# Altium schematic sheet FIT_FPGA_I-J-K.SchDoc: FIT_PM12 board
size 420 x 297 mm; CheckedBy: G.Kasprowicz; Author: INR Moscow; CompanyName: WUT ISE; DrawnBy: M.Podgórski; Organization: WUT ISE; Address1: PW ISE; Address2: Nowowiejska 15/19 00-665 Warsaw; Address3: gkasprow@gmail.com; Revision: 2; SheetNumber: -; SheetTotal: -; ModifiedBy: -; CheckedDate: -; Title2: Title 2; DivGrp: WUT ISE; Designer: INR RAS; ModifiedDate: -; ProjectName: Sensor Box
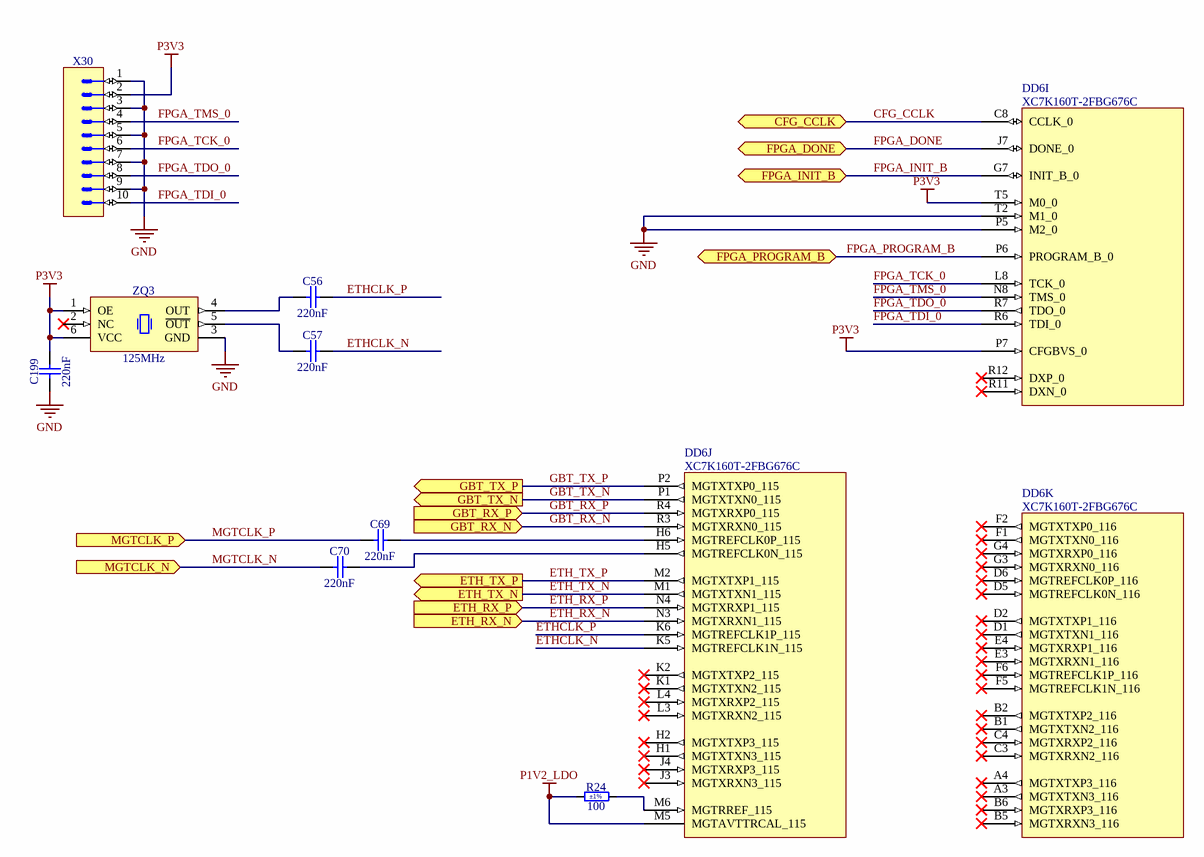
[diagram p0: FIT_FPGA_I-J-K.SchDoc]

## Parts
C56  220nF  [CAPC1608X87N]
C57  220nF  [CAPC1608X87N]
C69  220nF  [CAPC1608X87N]
C70  220nF  [CAPC1608X87N]
C199  220nF  [CAPC2012X135N]
DD6  XC7K160T-2FBG676C  [BGA676C100P26X26_2700X2700X254]  (parts I,J,K of 15)
R24  100  Tolerance: ±1%  [RESC1608X55N]
X30  (no value)  [CONNFLY_DS1014-10SF1B-B]
ZQ3  125MHz  [OSC_EPSON_SG5032VAN]

## Ports
CFG_CCLK (bidir), ETH_RX_N (in), ETH_RX_P (in), ETH_TX_N (out), ETH_TX_P (out), FPGA_DONE (bidir), FPGA_INIT_B (bidir), FPGA_PROGRAM_B (bidir), GBT_RX_N (in), GBT_RX_P (in), GBT_TX_N (out), GBT_TX_P (out), MGTCLK_N (in), MGTCLK_P (in)

## Nets
GND: C199.1 DD6.P5(M2_0) DD6.T2(M1_0) X30.1 X30.3 X30.5 X30.7 X30.9 ZQ3.3(GND)
P1V2_LDO: DD6.M5(MGTAVTTRCAL_115) R24.1
P3V3: C199.2 DD6.P7(CFGBVS_0) DD6.T5(M0_0) X30.2 ZQ3.1(OE) ZQ3.6(VCC)
CFG_CCLK: DD6.C8(CCLK_0) ; port CFG_CCLK
ETH_RX_N: DD6.N3(MGTXRXN1_115) ; port ETH_RX_N
ETH_RX_P: DD6.N4(MGTXRXP1_115) ; port ETH_RX_P
ETH_TX_N: DD6.M1(MGTXTXN1_115) ; port ETH_TX_N
ETH_TX_P: DD6.M2(MGTXTXP1_115) ; port ETH_TX_P
ETHCLK_N: C57.2 DD6.K5(MGTREFCLK1N_115)
ETHCLK_P: C56.2 DD6.K6(MGTREFCLK1P_115)
FPGA_DONE: DD6.J7(DONE_0) ; port FPGA_DONE
FPGA_INIT_B: DD6.G7(INIT_B_0) ; port FPGA_INIT_B
FPGA_PROGRAM_B: DD6.P6(PROGRAM_B_0) ; port FPGA_PROGRAM_B
FPGA_TCK_0: DD6.L8(TCK_0) X30.6
FPGA_TDI_0: DD6.R6(TDI_0) X30.10
FPGA_TDO_0: DD6.R7(TDO_0) X30.8
FPGA_TMS_0: DD6.N8(TMS_0) X30.4
GBT_RX_N: DD6.R3(MGTXRXN0_115) ; port GBT_RX_N
GBT_RX_P: DD6.R4(MGTXRXP0_115) ; port GBT_RX_P
GBT_TX_N: DD6.P1(MGTXTXN0_115) ; port GBT_TX_N
GBT_TX_P: DD6.P2(MGTXTXP0_115) ; port GBT_TX_P
MGTCLK_N: C70.1 ; port MGTCLK_N
MGTCLK_P: C69.1 ; port MGTCLK_P
NetC56_1: C56.1 ZQ3.4(OUT)
NetC57_1: C57.1 ZQ3.5(~{OUT})
NetC69_2: C69.2 DD6.H6(MGTREFCLK0P_115)
NetC70_2: C70.2 DD6.H5(MGTREFCLK0N_115)
NetDD6_M6: DD6.M6(MGTRREF_115) R24.2

Not connected (* = marked no-connect by the designer): DD6 A3(MGTXTXN3_116)* A4(MGTXTXP3_116)* B1(MGTXTXN2_116)* B2(MGTXTXP2_116)* B5(MGTXRXN3_116)* B6(MGTXRXP3_116)* C3(MGTXRXN2_116)* C4(MGTXRXP2_116)* D1(MGTXTXN1_116)* D2(MGTXTXP1_116)* D5(MGTREFCLK0N_116)* D6(MGTREFCLK0P_116)* E3(MGTXRXN1_116)* E4(MGTXRXP1_116)* F1(MGTXTXN0_116)* F2(MGTXTXP0_116)* F5(MGTREFCLK1N_116)* F6(MGTREFCLK1P_116)* G3(MGTXRXN0_116)* G4(MGTXRXP0_116)* H1(MGTXTXN3_115)* H2(MGTXTXP3_115)* J3(MGTXRXN3_115)* J4(MGTXRXP3_115)* K1(MGTXTXN2_115)* K2(MGTXTXP2_115)* L3(MGTXRXN2_115)* L4(MGTXRXP2_115)* R11(DXN_0)* R12(DXP_0)*; ZQ3 2(NC)*

## Notes on the sheet
- Project/Equipment
- Document
- Designer
- Drawn by
- Check.by
- Copyright WUT ISE 2024.
  This documentation describes Open Hardware and is licensed under the CERN OHL v.2. You may redistribute and modify this documentation under the terms of the CERN OHL v.2. (http://ohwr.org/CERNOHL). This documentation is distributed WITHOUT ANY EXPRESS OR IMPLIED WARRANTY, INCLUDING OF MERCHANTABILITY, SATISFACTORY QUALITY AND FITNESS FOR A PARTICULAR PURPOSE. Please see the CERN OHL v.2 for applicable conditions.
- Contact
- File
- Last Mod.
- Print Date
- Sheet
- Size
- A3
- of
- Rev

## Library data of the parts
C56 C57 C69 C70 = CC0603_220NF_25V_10%_X7R: Non-polarised capacitor; Part Description: SMD Multilayer Chip Ceramic Capacitor; Manufacturer: GENERIC; Manufacturer1 Part Number: C0603C224K3RACTU; Voltage: 25V; TC: X7R; Tolerance: ±10%; Part Number: CC0603_220NF_25V_10%_X7R; Component Kind: Standard; Component Type: Standard; Pin Count: 2; Value: 220nF; Status: Preferred; Manufacturer Part Number: CC0603_220NF_25V_10%_X7R; Case: 0603; Mounted: Yes; Socket: No; SMD: Yes; Sense: No; Manufacturer1 Example: KEMET; Manufacturer1 ComponentHeight: 0.87mm; HelpURL: \\cern.ch\dfs\Applications\Altium\Datasheets\CC0603_X7R_KEMET.pdf; Author: CERN DEM JLC; CreateDate: 29.10.2014; LatestRevisionDate: 29.10.2014
C199 = CC0805_220NF_50V_10%_X7R: Non-polarised capacitor; Part Description: SMD Multilayer Chip Ceramic Capacitor; Manufacturer: GENERIC; Manufacturer1 Part Number: GRM21BR71H224KA01L; Voltage: 50V; TC: X7R; Tolerance: ±10%; Part Number: CC0805_220NF_50V_10%_X7R; Component Kind: Standard; Component Type: Standard; Pin Count: 2; Value: 220nF; Status: Preferred; Manufacturer Part Number: CC0805_220NF_50V_10%_X7R; Case: 0805; Mounted: Yes; Socket: No; SMD: Yes; Sense: No; Manufacturer1 Example: MURATA; Manufacturer1 ComponentHeight: 1.35mm; HelpURL: \\cern.ch\dfs\Applications\Altium\Datasheets\CC0805_X7R_MURATA.pdf; Author: CERN DEM JLC; CreateDate: 03.12.2007; LatestRevisionDate: 03.12.2007
DD6 = XC7K160T-2FBG676C: KINTEX-7, FPGA, 676-Ball BGA, Pb-Free; Part Description: KINTEX-7 FPGA, 162240 Logic Cells, 400 User I/O, 8 GTXs, 676-Ball BGA, Speed Grade 2, Commercial Grade, Pb-Free; Manufacturer: XILINX; PressFit: No; Bonding: No; Part Number: XC7K160T-2FBG676C; Component Kind: Standard; Component Type: Standard; Device: XC7K160T-2FBG676C; PackageDescription: BGA, 1.00mm Pitch, Square; 676 Pin, 26 Columns X 26 Rows, Body 27.0mm X 27.0mm X 2.54mm H, IPC Medium Density; Manufacturer Part Number: XC7K160T-2FBG676C; Pin Count: 676; Case: BGA676; Mounted: Yes; Socket: No; SMD: Yes; Sense: No; ComponentHeight: 2.54mm; HelpURL: \\cern.ch\dfs\Applications\Altium\Datasheets\XC7K160T-xFBG676C.pdf; ComponentLink1URL: \\cern.ch\dfs\Applications\Altium\Datasheets\XC7K160T-xFBG676C_Package-Pinout.pdf; ComponentLink1Description: Package/Pinout; Author: CERN DEM BC; CreateDate: 06.02.2020; LatestRevisionDate: 06.02.2020
R24 = R0603_100R_1%_0.1W_100PPM: Resistor - 1%; Part Description: General Purpose Thick Film Chip Resistor; Manufacturer: GENERIC; Manufacturer1 Part Number: NRC06F4700TRF; Power: 0.1W; TC: ±100ppm/°C; PressFit: No; Part Number: R0603_100R_1%_0.1W_100PPM; Component Kind: Standard; Component Type: Standard; Pin Count: 2; Value: 100; Status: Preferred; Manufacturer Part Number: R0603_100R_1%_0.1W_100PPM; Case: 0603; Mounted: Yes; Sense: No; Socket: No; SMD: Yes; Manufacturer1 Example: NIC COMPONENT; Manufacturer1 ComponentHeight: 0.55mm; HelpURL: \\cern.ch\dfs\Applications\Altium\Datasheets\R0603_NIC_NRC.pdf; Author: CERN DEM JLC; CreateDate: 03.12.2007; LatestRevisionDate: 13.03.2008
X30 = CONNFLY_DS1014-10SF1B-B: Connector 10 Male; Part Description: 10 Contacts, 2.00mm Box Header V/T,R/A & SMT Type; PressFit: No; Part Number: CONNFLY_DS1014-10SF1B-B; Component Kind: Standard; Component Type: Standard; Pin Count: 10; Mounted: Yes; Socket: No; SMD: No; Sense: No; Status: None; Manufacturer: CONNFLY; Manufacturer Part Number: DS1014-10SF1B-B; ComponentHeight: 5.6mm; HelpURL: \\cern.ch\dfs\Applications\Altium\Datasheets\CONNFLY_DS1014-10SF1B-B.pdf; Author: CERN DEM HF; CreateDate: 29.05.2024; LatestRevisionDate: 29.05.2024
ZQ3 = OSC_125MHZ_EPSON_X1G0042610020: Low-Jitter Saw Oscillator (EG-2102 Serie); Part Description: 3.3V, ±30ppm, -40°C to +85°C, LVDS XO Oscillator, SG5032VAN Series; Manufacturer: EPSON; PressFit: No; Bonding: No; Part Number: OSC_125MHZ_EPSON_X1G0042610020; Component Kind: Standard; Component Type: Standard; PackageDescription: SMD Oscillator, Side Concave; 1.27mm Pitch; 6 Pins, 3.2mm L X 5.0mm W X 1.20mm H; Value: 125MHz; Manufacturer Part Number: X1G0042610020; Pin Count: 6; Mounted: Yes; Socket: No; SMD: Yes; Sense: No; ComponentHeight: 1.2mm; HelpURL: \\cern.ch\dfs\Applications\Altium\Datasheets\OSC_EPSON_X1G004261.pdf; Author: CERN DEM HF; CreateDate: 11.06.2024; LatestRevisionDate: 11.06.2024